# Altium schematic sheet Driver_Controller.SchDoc
size 500 x 300 mm; SheetNumber: 1; SheetTotal: 1
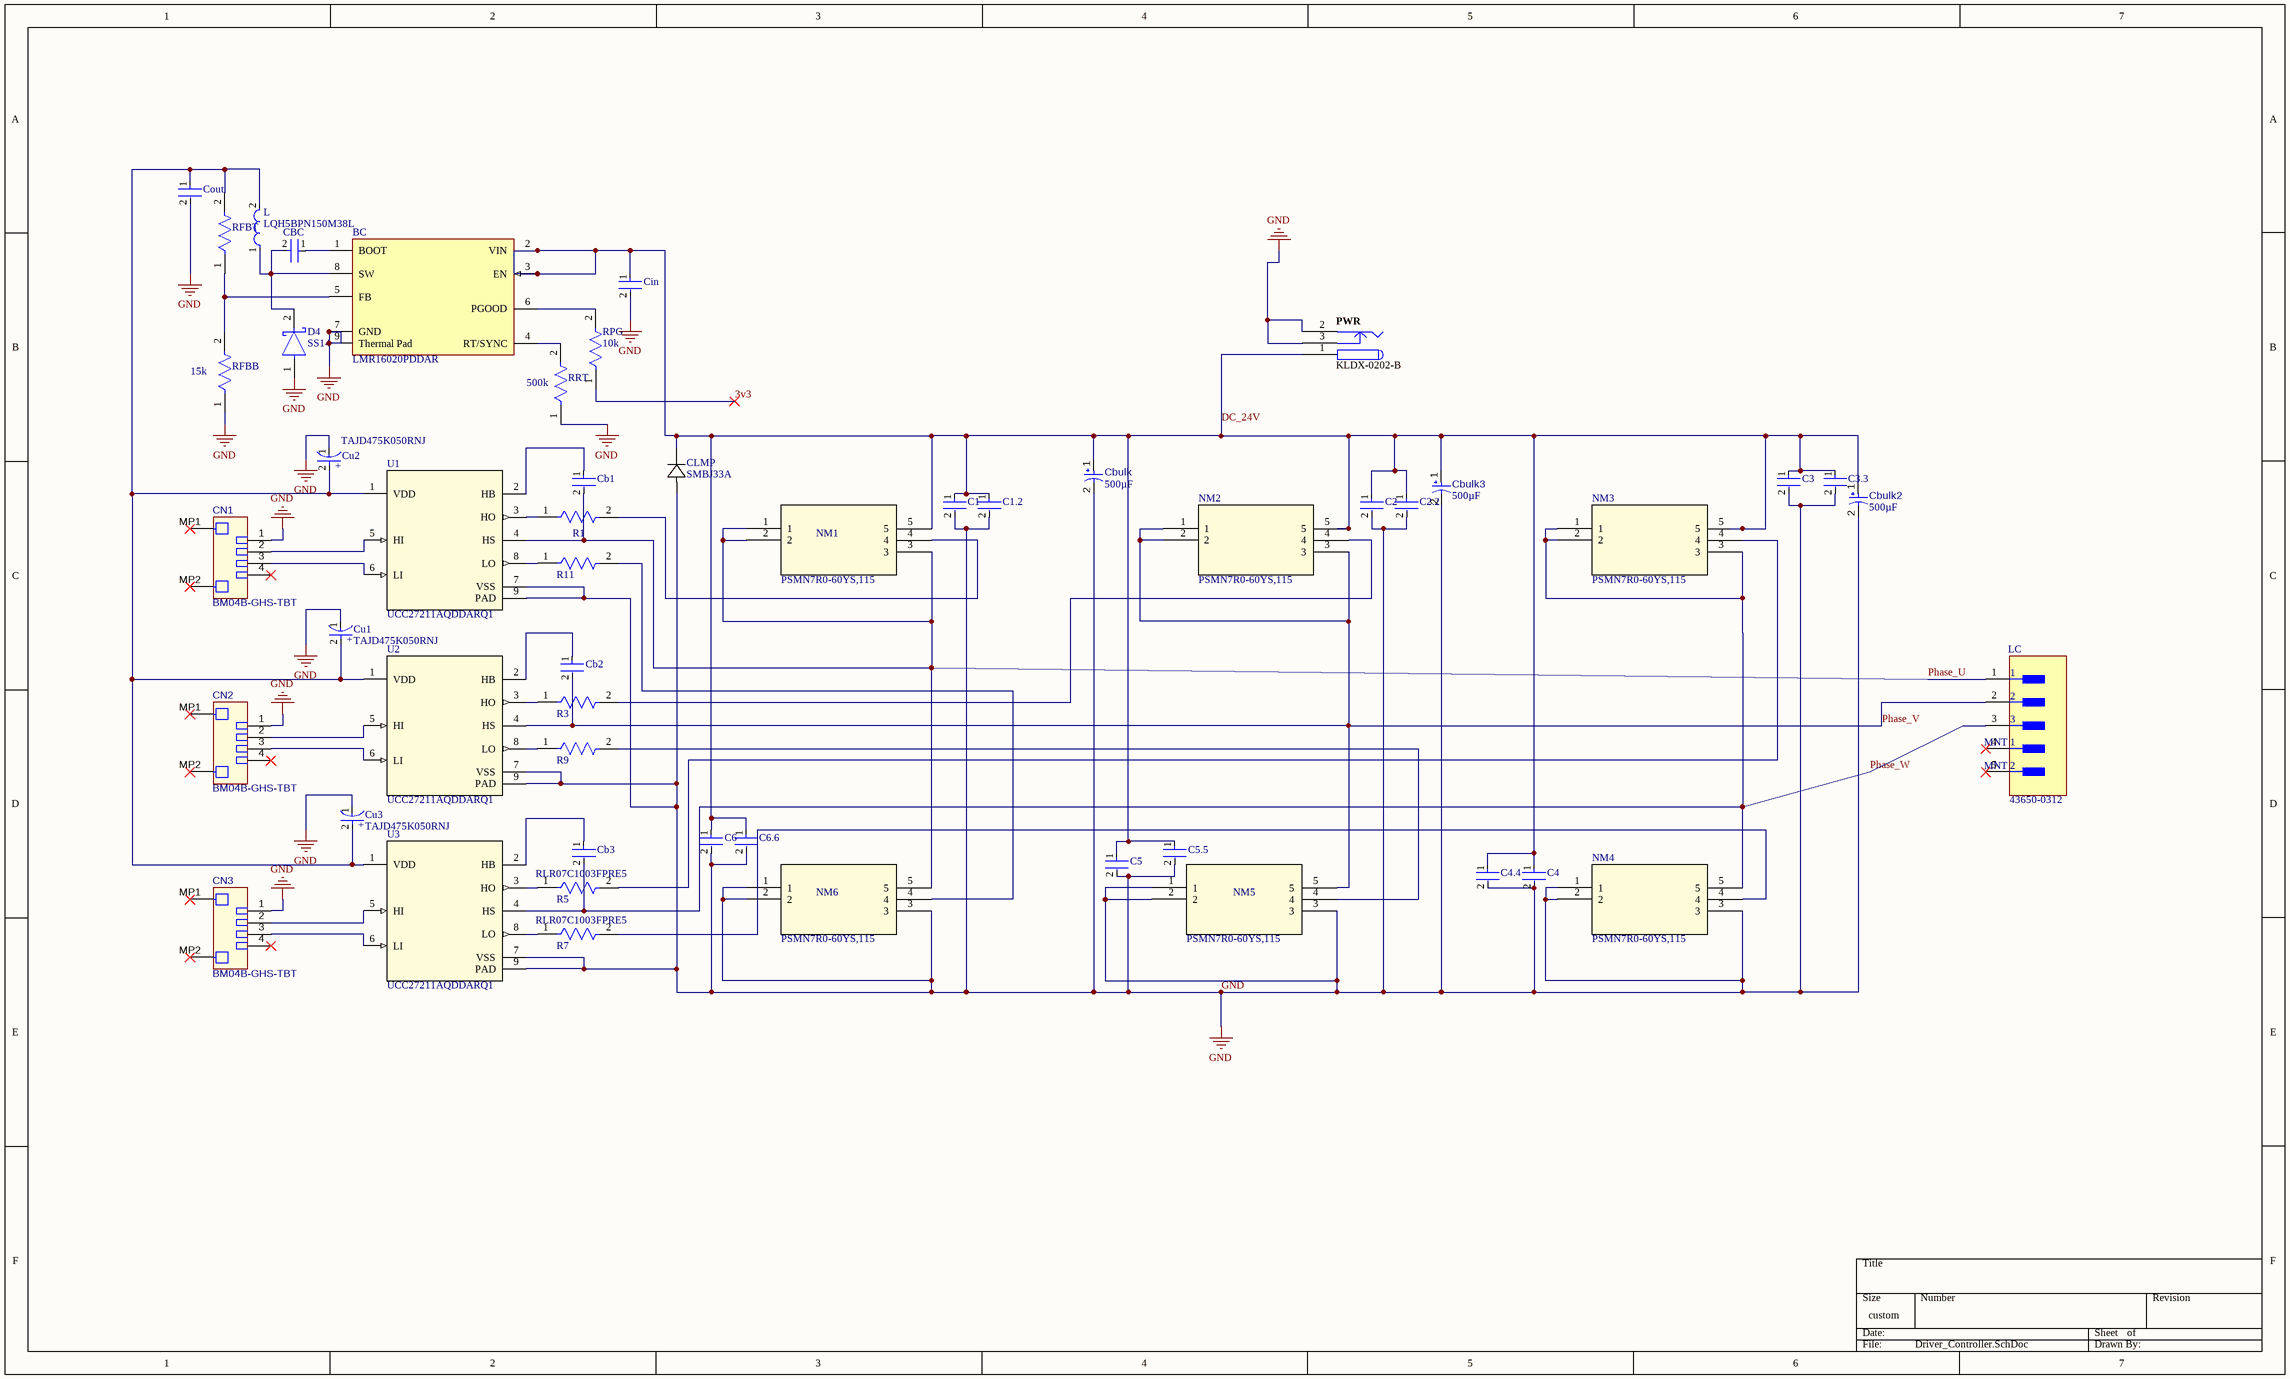
[diagram p0: Driver_Controller.SchDoc]

## Parts
BC  LMR16020PDDAR  [FP-DDA0008E-MFG]
C1  RCER72A104K1K1H03B  [FP-RCE1K1-2_5-MFG]  (value not drawn)
C1.2  RCER72A104K1K1H03B  [FP-RCE1K1-2_5-MFG]  (value not drawn)
C2  RCER72A104K1K1H03B  [FP-RCE1K1-2_5-MFG]  (value not drawn)
C2.2  RCER72A104K1K1H03B  [FP-RCE1K1-2_5-MFG]  (value not drawn)
C3  RCER72A104K1K1H03B  [FP-RCE1K1-2_5-MFG]  (value not drawn)
C3.3  RCER72A104K1K1H03B  [FP-RCE1K1-2_5-MFG]  (value not drawn)
C4  RCER72A104K1K1H03B  [FP-RCE1K1-2_5-MFG]  (value not drawn)
C4.4  RCER72A104K1K1H03B  [FP-RCE1K1-2_5-MFG]  (value not drawn)
C5  RCER72A104K1K1H03B  [FP-RCE1K1-2_5-MFG]  (value not drawn)
C5.5  RCER72A104K1K1H03B  [FP-RCE1K1-2_5-MFG]  (value not drawn)
C6  RCER72A104K1K1H03B  [FP-RCE1K1-2_5-MFG]  (value not drawn)
C6.6  RCER72A104K1K1H03B  [FP-RCE1K1-2_5-MFG]  (value not drawn)
Cb1  RCER72A104K1K1H03B  [FP-RCE1K1-2_5-MFG]  (value not drawn)
Cb2  RCER72A104K1K1H03B  [FP-RCE1K1-2_5-MFG]  (value not drawn)
Cb3  RCER72A104K1K1H03B  [FP-RCE1K1-2_5-MFG]  (value not drawn)
CBC  RCER72A104K1K1H03B  [FP-RCE1K1-2_5-MFG]  (value not drawn)
Cbulk  value 500µF  [CAPPR55-200-1100X500X1200]  (hidden comment: ECA1HM2R2)
Cbulk2  value 500µF  [CAPPR55-200-1100X500X1200]  (hidden comment: ECA1HM2R2)
Cbulk3  value 500µF  [CAPPR55-200-1100X500X1200]  (hidden comment: ECA1HM2R2)
Cin  RCER72A104K1K1H03B  [FP-RCE1K1-2_5-MFG]  (value not drawn)
CLMP  SMBJ33A  [SMB]
CN1  BM04B-GHS-TBT  [JST-BM04B-GHS-TBT_V]
CN2  BM04B-GHS-TBT  [JST-BM04B-GHS-TBT_V]
CN3  BM04B-GHS-TBT  [JST-BM04B-GHS-TBT_V]
Cout  RCER72A104K1K1H03B  [FP-RCE1K1-2_5-MFG]  (value not drawn)
Cu1  TAJD475K050RNJ  [FP-TAJD-MFG]
Cu2  TAJD475K050RNJ  [FP-TAJD-MFG]
Cu3  TAJD475K050RNJ  [FP-TAJD-MFG]
D4  SS14  [FP-403AE-MFG]
L  LQH5BPN150M38L  [FP-LQH5BPN_38-MFG]
LC  43650-0312  [FP-43650-0312-MFG]
NM1  PSMN7R0-60YS,115  [IC5_PSMN7R0-60YS,115_NEX-L]
NM2  PSMN7R0-60YS,115  [IC5_PSMN7R0-60YS,115_NEX-L]
NM3  PSMN7R0-60YS,115  [IC5_PSMN7R0-60YS,115_NEX-L]
NM4  PSMN7R0-60YS,115  [IC5_PSMN7R0-60YS,115_NEX-L]
NM5  PSMN7R0-60YS,115  [IC5_PSMN7R0-60YS,115_NEX-L]
NM6  PSMN7R0-60YS,115  [IC5_PSMN7R0-60YS,115_NEX-L]
PWR  KLDX-0202-B  [KYCN-KLDX-0202-B_V]
R1  RLR07C1003FPRE5  [FP-RLR07-MFG]  (value not drawn)
R3  RLR07C1003FPRE5  [FP-RLR07-MFG]  (value not drawn)
R5  RLR07C1003FPRE5  [FP-RLR07-MFG]
R7  RLR07C1003FPRE5  [FP-RLR07-MFG]
R9  RLR07C1003FPRE5  [FP-RLR07-MFG]  (value not drawn)
R11  RLR07C1003FPRE5  [FP-RLR07-MFG]  (value not drawn)
RFBB  15k  [FP-RLR07-MFG]
RFBT  150k  [FP-RLR07-MFG]  (value not drawn)
RPG  10k  [FP-RLR07-MFG]
RRT  500k  [FP-RLR07-MFG]
U1  UCC27211AQDDARQ1  [DDA0008E_N]
U2  UCC27211AQDDARQ1  [DDA0008E_N]
U3  UCC27211AQDDARQ1  [DDA0008E_N]

## Nets
GND: BC.7(GND) BC.9(Thermal_Pad) C1.2 C1.2.2 C2.2 C2.2.2 C3.2 C3.3.2 C4.2 C4.4.2 C5.2 C5.5.2 C6.2 C6.6.2 Cbulk.2 Cbulk2.2 Cbulk3.2 Cin.2 CLMP.2 CN1.1 CN2.1 CN3.1 Cout.2 Cu1.1(C) Cu2.1(C) Cu3.1(C) D4.1(A) NM4.1 NM4.2 NM4.3 NM5.1 NM5.2 NM5.3 NM6.1 NM6.2 NM6.3 PWR.2 PWR.3 RFBB.1 RRT.1 U1.7(VSS) U1.9(PAD) U2.7(VSS) U2.9(PAD) U3.7(VSS) U3.9(PAD)
3v3: RPG.1
DC_24V: BC.2(VIN) BC.3(EN) C1.1 C1.2.1 C2.1 C2.2.1 C3.1 C3.3.1 C4.1 C4.4.1 C5.1 C5.5.1 C6.1 C6.6.1 Cbulk.1 Cbulk2.1 Cbulk3.1 Cin.1 CLMP.1 NM1.5 NM2.5 NM3.5 PWR.1
Phase_U: Cb1.2 LC.1 NM1.1 NM1.2 NM1.3 NM6.5 U1.4(HS)
Phase_V: Cb2.2 LC.2 NM2.1 NM2.2 NM2.3 NM5.5 U2.4(HS)
Phase_W: Cb3.2 LC.3 NM3.1 NM3.2 NM3.3 NM4.5 U3.4(HS)
NetBC_1: BC.1(BOOT) CBC.1
NetBC_4: BC.4(RT/SYNC) RRT.2
NetBC_5: BC.5(FB) RFBB.2 RFBT.1
NetBC_6: BC.6(PGOOD) RPG.2
NetBC_8: BC.8(SW) CBC.2 D4.2(C) L.1
NetCb1_1: Cb1.1 U1.2(HB)
NetCb2_1: Cb2.1 U2.2(HB)
NetCb3_1: Cb3.1 U3.2(HB)
NetCN1_2: CN1.2 U1.5(HI)
NetCN1_3: CN1.3 U1.6(LI)
NetCN2_2: CN2.2 U2.5(HI)
NetCN2_3: CN2.3 U2.6(LI)
NetCN3_2: CN3.2 U3.5(HI)
NetCN3_3: CN3.3 U3.6(LI)
NetCout_1: Cout.1 Cu1.2(A) Cu2.2(A) Cu3.2(A) L.2 RFBT.2 U1.1(VDD) U2.1(VDD) U3.1(VDD)
NetNM1_4: NM1.4 R1.2
NetNM2_4: NM2.4 R3.2
NetNM3_4: NM3.4 R5.2
NetNM4_4: NM4.4 R7.2
NetNM5_4: NM5.4 R9.2
NetNM6_4: NM6.4 R11.2
NetR1_1: R1.1 U1.3(HO)
NetR3_1: R3.1 U2.3(HO)
NetR5_1: R5.1 U3.3(HO)
NetR7_1: R7.1 U3.8(LO)
NetR9_1: R9.1 U2.8(LO)
NetR11_1: R11.1 U1.8(LO)

Not connected (* = marked no-connect by the designer): CN1 4* MP1* MP2*; CN2 4* MP1* MP2*; CN3 4* MP1* MP2*; LC 4(MNT_1)* 5(MNT_2)*

## Notes on the sheet
- (in symbol CMP-04424-000309-1) +

## Library data of the parts
BC = CMP-04918-000084-1: IC REG BUCK ADJUSTABLE 2A 8SOPWR; Manufacturer: Texas Instruments; Output Voltage: 0.8-50V; Number Of Outputs: 1; Nominal Supply Current: 40uA; Max Junction Temp: +125°C; Output Type: AdjustableProgrammable; Min Supply Voltage: 4.3V; Max Duty Cycle: 97%; Max Supply Voltage: 60V; Standoff Height: 0mm; Switching Frequency: 2500kHz; Temperature Range Low: -40°C; RoHS: TRUE; Lead Free: Yes; Height: 1.7mm; Category: IC; Output Current: 2A; Manufacturer Part Number: LMR16020PDDAR; Octopart: https://octopart.com/lmr16020pddar-texas+instruments-70110951; Switching Topology: Buck; Package: DDA0008E; ComponentLink2URL: http://www.ti.com/lit/ds/symlink/lmr16020.pdf; Temperature Range High: +125°C; Device Class L1: Integrated Circuits (ICs); Automotive: No; Digikey Description: IC REG BUCK ADJUSTABLE 2A 8SOPWR; Mouser Description: SIMPLE SWITCHER? 60V, 2A Step-Down Converter with 40uA Iq 8-SO PowerPAD -40 to 125; Device Class L3: Voltage Regulators - Switching; Temperature: -40°C to +125°C; Device Class L2: Power Management ICs; ComponentLink2Description: Datasheet
C1 = CMP-06035-011084-1: 1uF; Voltage Rating: 100V; Capacitance: 100nF; Dielectric: X7R; Tolerance: 10%; Lead/Base Style: Formed Leads; Lead Diameter: 0.5mm; Resistor Type: Ceramic; Case/Package: Radial; Packaging: Bulk; Lead Pitch: 0.197inch; Height - Seated (Max): 0.138inch; Voltage Rating (DC): 100V; Mount: Through Hole; Height: 3.5mm; Width: 0.098inch; Termination: Radial; Min Operating Temperature: -55°C; Package Quantity: 500; Max Operating Temperature: 125°C; Length: 0.157inch; Ratings: AEC-Q200
C1.2 C2 C2.2 C3 C3.3 C4 C4.4 C5 C5.5 C6 C6.6 Cb2 Cb3 = CMP-06035-011084-1: Cap Ceramic Monolithic 100nF 100V 10% Thru-Hole Bulk; Dielectric: X7R; Lead/Base Style: Formed Leads; Lead Diameter: 0.5mm; Resistor Type: Ceramic; Voltage Rating: 100V; Case/Package: Radial; Packaging: Bulk; Capacitance: 100nF; Lead Pitch: 0.197inch; Height - Seated (Max): 0.138inch; Voltage Rating (DC): 100V; Mount: Through Hole; Height: 3.5mm; Width: 0.098inch; Termination: Radial; Tolerance: 10%; Min Operating Temperature: -55°C; Package Quantity: 500; Max Operating Temperature: 125°C; Length: 0.157inch; Ratings: AEC-Q200
Cb1 = CMP-06035-011084-1: 0.22uF; Voltage Rating: 100V; Capacitance: 100nF; Dielectric: X7R; Tolerance: 10%; Lead/Base Style: Formed Leads; Lead Diameter: 0.5mm; Resistor Type: Ceramic; Case/Package: Radial; Packaging: Bulk; Lead Pitch: 0.197inch; Height - Seated (Max): 0.138inch; Voltage Rating (DC): 100V; Mount: Through Hole; Height: 3.5mm; Width: 0.098inch; Termination: Radial; Min Operating Temperature: -55°C; Package Quantity: 500; Max Operating Temperature: 125°C; Length: 0.157inch; Ratings: AEC-Q200
CBC = CMP-06035-011084-1: 0.1 uF cermaic; Voltage Rating: 100V; Capacitance: 100nF; Dielectric: X7R; Tolerance: 10%; Lead/Base Style: Formed Leads; Lead Diameter: 0.5mm; Resistor Type: Ceramic; Case/Package: Radial; Packaging: Bulk; Lead Pitch: 0.197inch; Height - Seated (Max): 0.138inch; Voltage Rating (DC): 100V; Mount: Through Hole; Height: 3.5mm; Width: 0.098inch; Termination: Radial; Min Operating Temperature: -55°C; Package Quantity: 500; Max Operating Temperature: 125°C; Length: 0.157inch; Ratings: AEC-Q200
Cbulk = CMP-001-00029-7: 220 uF electrolytic capacitor 50V; Manufacturer: Panasonic; Tolerance: 20%; Ripple Current: 20mA; Package Description: 2-Pin Radial Lead, Dia 5 mm, Height 12 mm; Manufacturer URL: http://www.panasonic.com/; Voltage Rating: 50V; Diameter: 5mm; Pins: 2; Mounting Technology: TH; Capacitor Type: Electrolytic; RoHS Compliant: True; Min Operating Temperature: -40°C; Case/Package: Radial; Datasheet URL: https://industrial.panasonic.com/cdbs/www-data/pdf/RDF0000/ABA0000C1218.pdf; Lead Pitch: 2mm; Max Operating Temperature: 85°C; Packaging: Bulk; Package Reference: CAPPR55-200-1100X500X1200; Datasheet Version: Rev. 05, 10/2016; Ripple Current (AC): 20mA; Package Quantity: 200
Cbulk2 Cbulk3 = CMP-001-00029-7: Aluminum Electrolytic Capacitor, 2.2 uF, +/- 20%, 50 V, -40 to 85 degC, 2-Pin THD, RoHS, Bulk; Manufacturer: Panasonic; Voltage Rating: 50V; Ripple Current: 20mA; Package Description: 2-Pin Radial Lead, Dia 5 mm, Height 12 mm; Manufacturer URL: http://www.panasonic.com/; Tolerance: 20%; Diameter: 5mm; Pins: 2; Mounting Technology: TH; Capacitor Type: Electrolytic; RoHS Compliant: True; Min Operating Temperature: -40°C; Case/Package: Radial; Datasheet URL: https://industrial.panasonic.com/cdbs/www-data/pdf/RDF0000/ABA0000C1218.pdf; Lead Pitch: 2mm; Max Operating Temperature: 85°C; Packaging: Bulk; Package Reference: CAPPR55-200-1100X500X1200; Datasheet Version: Rev. 05, 10/2016; Ripple Current (AC): 20mA; Package Quantity: 200
Cin = CMP-06035-011084-1: 10uF; Voltage Rating: 100V; Capacitance: 100nF; Dielectric: X7R; Tolerance: 10%; Lead/Base Style: Formed Leads; Lead Diameter: 0.5mm; Resistor Type: Ceramic; Case/Package: Radial; Packaging: Bulk; Lead Pitch: 0.197inch; Height - Seated (Max): 0.138inch; Voltage Rating (DC): 100V; Mount: Through Hole; Height: 3.5mm; Width: 0.098inch; Termination: Radial; Min Operating Temperature: -55°C; Package Quantity: 500; Max Operating Temperature: 125°C; Length: 0.157inch; Ratings: AEC-Q200
CLMP = SMBJ33A: No Description Available; Manufacturer_Name: Bourns Electronics; Copyright: Copyright (C) 2025 Ultra Librarian. All rights reserved.; Manufacturer_Part_Number: SMBJ33A
CN1-CN3 = CMP-002-00053-3: Header, Pitch 1.25 mm, 1 x 4 Position, Height 4.05 mm, -25 to 85 degC; Pins: 6
Cout = CMP-06035-011084-1: 47 uF cap; Voltage Rating: 100V; Capacitance: 100nF; Dielectric: X7R; Tolerance: 10%; Lead/Base Style: Formed Leads; Lead Diameter: 0.5mm; Resistor Type: Ceramic; Case/Package: Radial; Packaging: Bulk; Lead Pitch: 0.197inch; Height - Seated (Max): 0.138inch; Voltage Rating (DC): 100V; Mount: Through Hole; Height: 3.5mm; Width: 0.098inch; Termination: Radial; Min Operating Temperature: -55°C; Package Quantity: 500; Max Operating Temperature: 125°C; Length: 0.157inch; Ratings: AEC-Q200
Cu1-Cu3 = CMP-04424-000309-1: 4.7uF 50V  ±10% 1.4Ω 2917  SMD Tantalum Capacitor; Polarity: Polar; Dissipation Factor: 6%; Leakage Current: 2.4uA; ESR (Equivalent Series Resistance): 1.4R; Case/Package: 2917; Lead Free: Lead Free; Lead Pitch: 4.4mm; Case Code (Imperial): 2917; Height: 2.9mm; Height - Seated (Max): 0.122inch; Voltage Rating: 50V; Series: TAJ; Features: General Purpose; Tolerance: 10%; Voltage Rating (DC): 50V; Max Operating Temperature: 125°C; Min Operating Temperature: -55°C; Depth: 4.3mm; Case Code (Metric): 7343; Capacitance: 4.7uF; Construction: Flat; Number of Pins: 2; Termination: SMD/SMT; RoHS Compliant: Yes; Width: 4.3mm; Voltage: 50V; Mount: Surface Mount; Packaging: Tape and Reel; Length: 7.3mm; Radiation Hardening: No; REACH SVHC: No SVHC; Dielectric Material: Tantalum; Package Quantity: 1
D4 = CMP-2000-04943-2: DIODE SCHOTTKY 40V 1A SMA; Manufacturer: ON Semiconductor; Peak Reverse Current: 0.2mA; Max Junction Temp: +125°C; Standoff Height: 0.05mm; Max Surge Forward Current: 40A; Mouser Description: Schottky Diodes & Rectifiers SMA 40V 1.0A; RoHS: TRUE; Lead Free: Yes; Manufacturer Part Number: SS14; Device Class L3: Schottky Diodes; Category: Diode; Automotive: No; Digikey Description: DIODE SCHOTTKY 40V 1A SMA; ComponentLink2Description: Datasheet; Device Class L2: Diodes; Height: 2.5mm; Temperature Range High: +125°C; ComponentLink2URL: https://www.onsemi.com/pub/Collateral/SS19-D.PDF; Device Class L1: Discrete Semiconductors; Package: 403AE; Octopart: https://octopart.com/ss14-on+semiconductor-29205033; Max Repetitive Reverse Voltage: 40V; Temperature Range Low: -65°C; Forward Current: 1A; Temperature: -65°C to +125°C
L = CMP-06042-009395-1: Wire Wound Ferrite Inductor for Power Lines 15μH ±20% 0.096Ω 1900mA 2020
LC = CMP-04771-000004-1: CONN HEADER SMD R/A 3POS 3MM; Manufacturer: Molex; Is Female: yes; Current Rating: 8.5A; Conn Orientation: Right Angle; Number Of Contacts: 3; Conn Gender: Male; Voltage Rating: 600V; Contact Material: Tin,Nickel; Mouser Description: Headers & Wire Housings R/A HDR SMT 3P TIN w/Fitting Nail; Manufacturer Part Number: 43650-0312; Temperature Range Low: -40°C; Octopart: https://octopart.com/43650-0312-molex-298103; RoHS: TRUE; Automotive: No; Lead Free: Yes; Temperature Range High: +105°C; Device Class L1: Connectors; Height: 6.07mm; ComponentLink2Description: Datasheet; Package: 43650-0312; Footprint Url: https://www.molex.com/pdm_docs/sd/436500312_sd.pdf; Device Class L3: unset; Category: Conn; ComponentLink2URL: https://www.molex.com/webdocs/datasheets/pdf/en-us/0436500312_PCB_HEADERS.pdf; Temperature: -40°C to +105°C; Pitch: 3mm; Digikey Description: CONN HEADER SMD R/A 3POS 3MM; Number Of Rows: 1; Device Class L2: Board to Board Connectors
NM1-NM6 = PSMN7R0-60YS,115: No Description Available; Manufacturer_Name: Nexperia; Copyright: Copyright (C) 2025 Ultra Librarian. All rights reserved.; Manufacturer_Part_Number: PSMN7R0-60YS,115; RefDes: RefDes; Type: Type
PWR = CMP-0256-00001-1: 3 Conductor Power Jack, 2 break 2 aux contacts; ComponentLink2URL: http://anacapa.kycon.com/Catalog_PDF/KLDX_0202.pdf; PackageReference: KLDX-0202-B; Contact Finish: Brass; ComponentLink2Description: Datasheet; Mounting Technology: Through Hole; PackageDescription: Jack, 9 x 14.5 mm Body, 2.5 mm Center Pin Diameter; ComponentLink1Description: Manufacturer URL; PartNumber: KLDX-0202-B; ComponentLink1URL: http://kycon.com/
R1 R3 R5 R7 R9 RFBB RFBT RPG RRT = CMP-00030-43622365-1: RLR07C1003FPRE5 Resistor, 100 kOhm, ± 1%, 250 mW, Axial Leaded, Metal Film, Military Reliability; Resistance: 100kΩ; Temperature Coefficient: 100ppm/°C; RoHS: Non-Compliant; Packaging: Tape & Reel; Max Operating Temperature: 150°C; Composition: Metal Film; Contact Plating: Lead, Tin; Tolerance: 1%; Military Standard: MIL-PRF-39017; Diameter: 2.29mm; Case/Package: Conformal; Mount: Through Hole; Length: 7.62mm; NexarPartId: 43622365; Min Operating Temperature: -65°C; Radiation Hardening: No
R11 = CMP-00030-43622365-1: 10; Resistance: 100kΩ; Tolerance: 1%; Temperature Coefficient: 100ppm/°C; RoHS: Non-Compliant; Packaging: Tape & Reel; Max Operating Temperature: 150°C; Composition: Metal Film; Contact Plating: Lead, Tin; Military Standard: MIL-PRF-39017; Diameter: 2.29mm; Case/Package: Conformal; Mount: Through Hole; Length: 7.62mm; NexarPartId: 43622365; Min Operating Temperature: -65°C; Radiation Hardening: No
U1-U3 = UCC27211AQDDARQ1: Automotive 4-A, 120-V half bridge gate driver with 8-V UVLO and negative voltage handling 8-SO PowerPAD -40 to 150; Manufacturer_Name: Texas Instruments; TYPE: TYPE; RefDes: RefDes; Copyright: Copyright (C) 2025 Ultra Librarian. All rights reserved.; Manufacturer_Part_Number: UCC27211AQDDARQ1; Datasheet: https://www.ti.com/lit/gpn/ucc27211a-q1